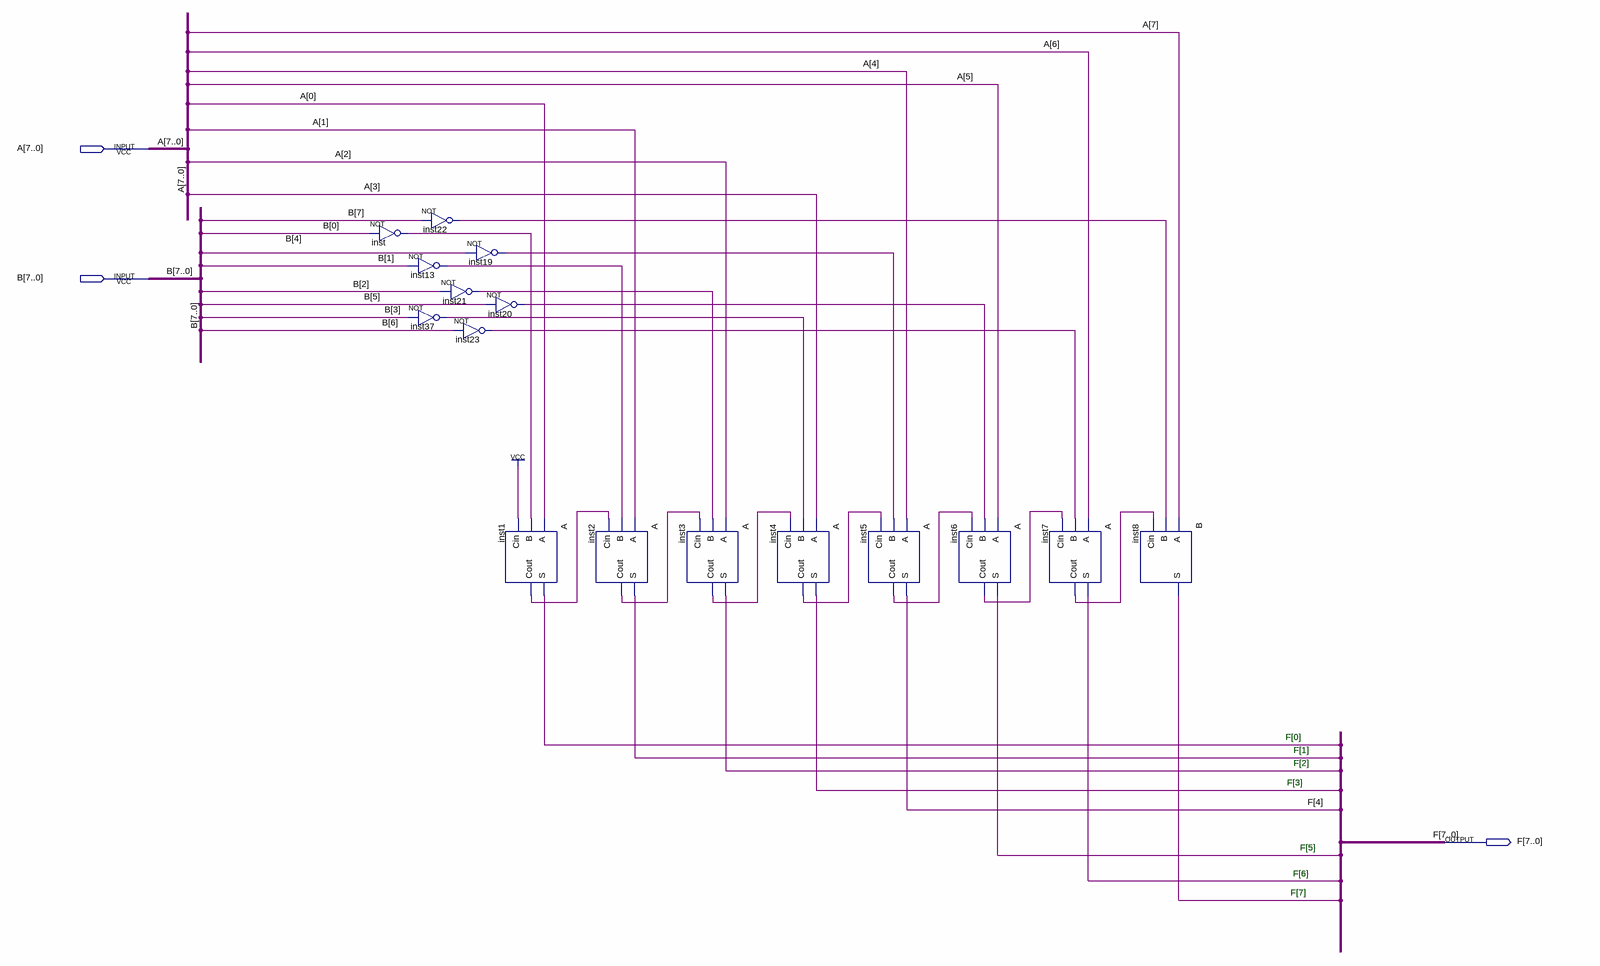
[diagram p0: schematic sheet]
// Quartus schematic BA.bdf as structural Verilog: 16 symbols, 3 pins
module BA (
  input  [7:0] A,
  input  [7:0] B,
  output [7:0] F
);

  wire inst1_cout, inst2_cout, inst3_cout, inst4_cout, inst5_cout, inst6_cout, inst7_cout, inst13_out,
       inst19_out, inst20_out, inst21_out, inst22_out, inst23_out, inst37_out, inst_out;

  not inst (inst_out, B[0]);
  not inst22 (inst22_out, B[7]);
  not inst13 (inst13_out, B[1]);
  not inst21 (inst21_out, B[2]);
  not inst37 (inst37_out, B[3]);
  not inst23 (inst23_out, B[6]);
  not inst19 (inst19_out, B[4]);
  not inst20 (inst20_out, B[5]);
  A inst1 (.A(A[0]), .B(inst_out), .Cin(1'b1), .S(F[0]), .Cout(inst1_cout));
  A inst2 (.A(A[1]), .B(inst13_out), .Cin(inst1_cout), .S(F[1]), .Cout(inst2_cout));
  A inst3 (.A(A[2]), .B(inst21_out), .Cin(inst2_cout), .S(F[2]), .Cout(inst3_cout));
  A inst4 (.A(A[3]), .B(inst37_out), .Cin(inst3_cout), .S(F[3]), .Cout(inst4_cout));
  A inst5 (.A(A[4]), .B(inst19_out), .Cin(inst4_cout), .S(F[4]), .Cout(inst5_cout));
  A inst6 (.A(A[5]), .B(inst20_out), .Cin(inst5_cout), .S(F[5]), .Cout(inst6_cout));
  A inst7 (.A(A[6]), .B(inst23_out), .Cin(inst6_cout), .S(F[6]), .Cout(inst7_cout));
  B inst8 (.A(A[7]), .B(inst22_out), .Cin(inst7_cout), .S(F[7]));

  // Notes on the sheet:
  //   F[0]
  //   F[1]
  //   F[2]
  //   F[3]
  //   F[5]
  //   F[6]
  //   F[7]
endmodule
